# Altium schematic sheet Buck_60W20V_Control_Section.SchDoc
size A4; SheetNumber: 3; SheetTotal: 6
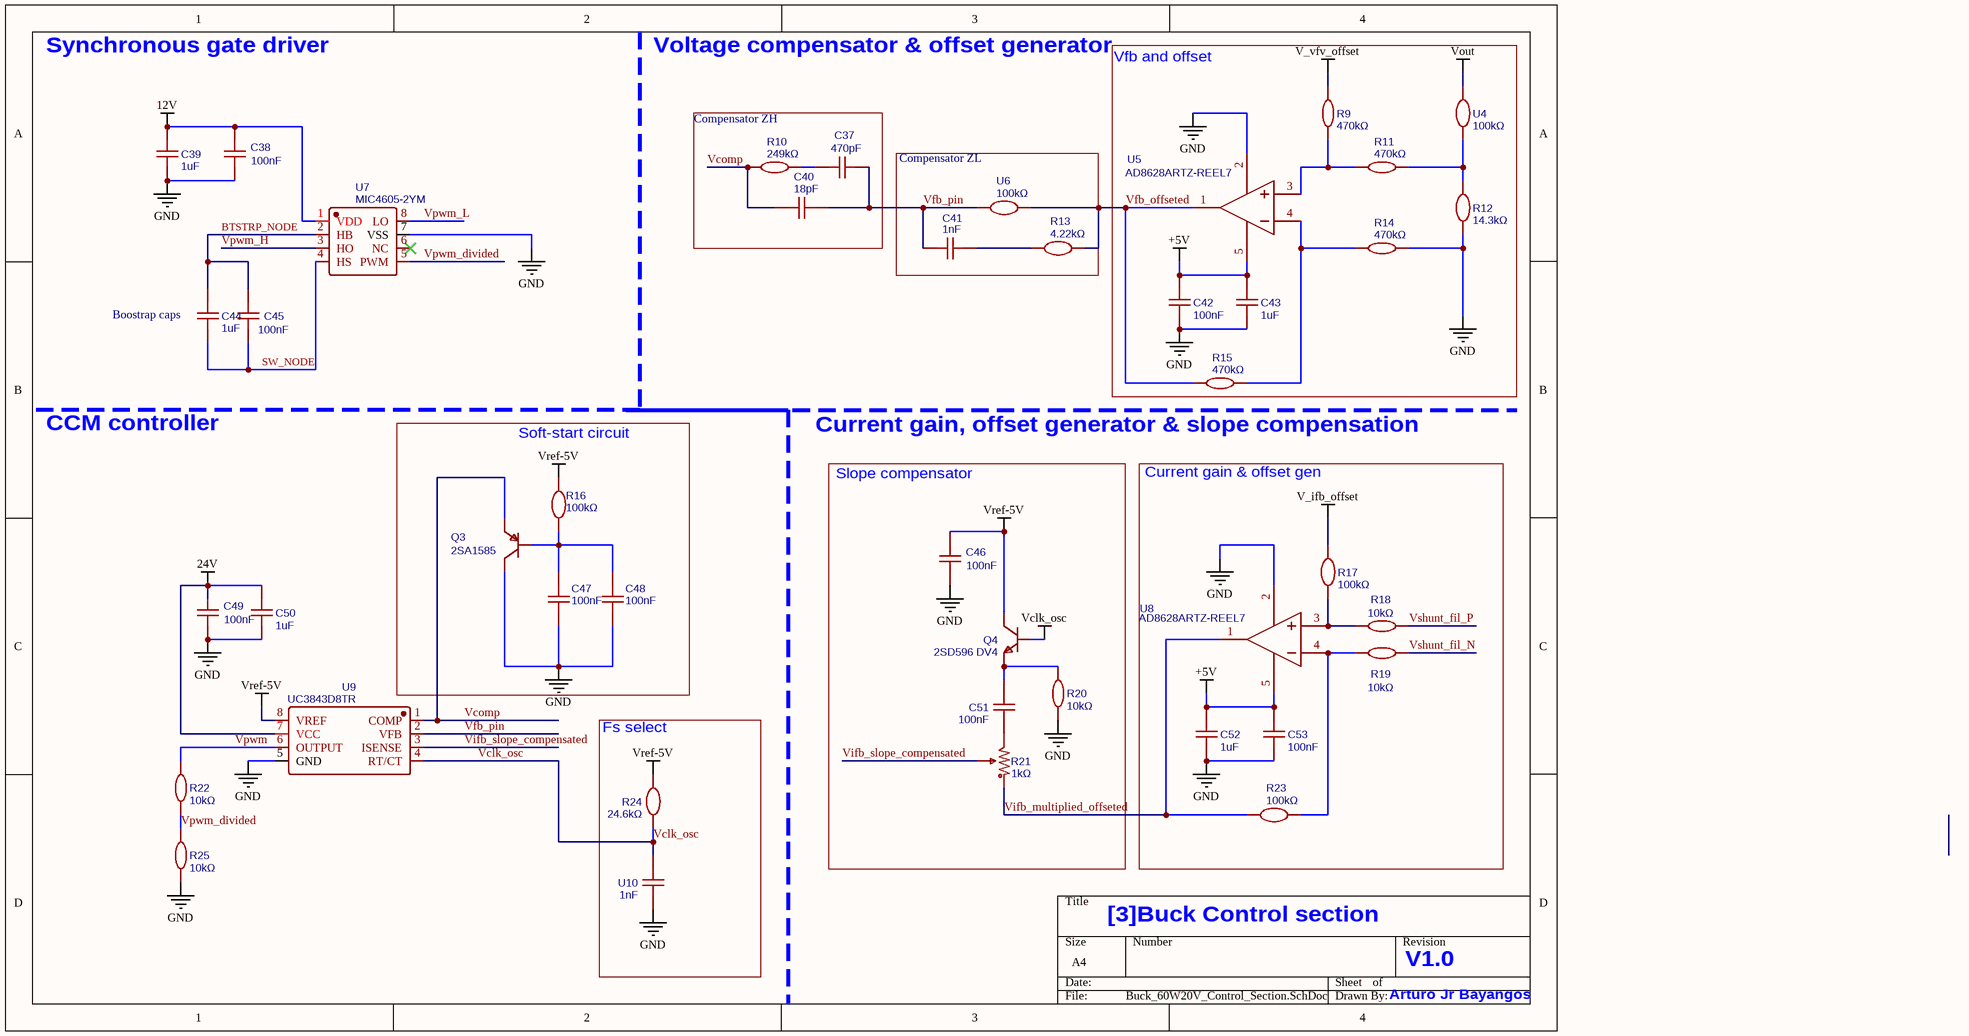
[diagram p0: Buck_60W20V_Control_Section.SchDoc]

## Parts
C37  470pF  [C0603]
C38  100nF  [C0402]
C39  1uF  [C0603]
C40  18pF  [C0603]
C41  1nF  [C0603]
C42  100nF  [C0402]
C43  1uF  [C0603]
C44  1uF  [C0603]
C45  100nF  [C0402]
C46  100nF  [C0402]
C47  100nF  [C0402]
C48  100nF  [C0402]
C49  100nF  [C0402]
C50  1uF  [C0603]
C51  100nF  [C0402]
C52  1uF  [C0603]
C53  100nF  [C0402]
Q3  2SA1585  [SOT-23-3_L2.9-W1.6-P1.90-LS2.8-BR]
Q4  2SD596 DV4  [SOT-23-3_L2.9-W1.6-P1.90-LS2.8-BR]
R9  470kΩ  [R0603]
R10  249kΩ  [R0603]
R11  470kΩ  [R0603]
R12  14.3kΩ  [R0603]
R13  4.22kΩ  [R0603]
R14  470kΩ  [R0603]
R15  470kΩ  [R0603]
R16  100kΩ  [R0603]
R17  100kΩ  [R0603]
R18  10kΩ  [R0603]
R19  10kΩ  [R0603]
R20  10kΩ  [R0603]
R21  1kΩ  [RES-ADJ-TH_3296W]
R22  10kΩ  [R0603]
R23  100kΩ  [R0603]
R24  24.6kΩ  [R0603]
R25  10kΩ  [R0603]
U4  100kΩ  [R0603]
U5  AD8628ARTZ-REEL7  [SOT-23-5_L3.0-W1.7-P0.95-LS2.8-BR]
U6  100kΩ  [R0603]
U7  MIC4605-2YM  [SOIC-8_L4.9-W3.9-P1.27-LS6.0-BL]
U8  AD8628ARTZ-REEL7  [SOT-23-5_L3.0-W1.7-P0.95-LS2.8-BR]
U9  UC3843D8TR  [SOIC-8_L4.9-W3.9-P1.27-LS6.0-TL]
U10  1nF  [C0201]

## Blocks framed on the sheet
Vfb and offset: C42 C43 R9 R11 R12 R14 R15 U4 U5
Compensator ZH: C37 C40 R10
Compensator ZL: C41 R13 U6
Soft-start circuit: C47 C48 Q3 R16
Slope compensator: C46 C51 Q4 R20 R21
Current gain & offset gen: C52 C53 R17-R19 R23 U8
Fs select: R24 U10

## Nets
12V: C38.2 C39.1 U7.1(VDD)
24V: C49.2 C50.2 U9.7(VCC)
+5V: C42.2 C43.2 C52.2 C53.2 U5.5(+V) U8.5(+V)
GND: C38.1 C39.2 C42.1 C43.1 C46.1 C47.1 C48.1 C49.1 C50.1 C52.1 C53.1 Q3.3(C) R12.1 R14.2 R20.1 R25.1 U5.2(-V) U7.7(VSS) U8.2(-V) U9.5(GND) U10.1
V_ifb_offset: R17.2
V_vfv_offset: R9.2
Vclk_osc: Q4.1(B) R24.1 U9.4(RT/CT) U10.2
Vout: U4.2
Vref-5V: C46.2 Q4.3(C) R16.2 R24.2 U9.8(VREF)
BTSTRP_NODE: C44.1 C45.2 U7.2(HB)
SW_NODE: C44.2 C45.1 U7.4(HS)
Vcomp: C40.2 Q3.2(E) R10.2 U9.1(COMP)
Vfb_offseted: R13.2 R15.1 U5.1(OUT) U6.1
Vfb_pin: C37.2 C40.1 C41.1 U6.2 U9.2(VFB)
Vifb_multiplied_offseted: R21.1 R23.1 U8.1(OUT)
Vifb_slope_compensated: R21.2 U9.3(ISENSE)
Vpwm: R22.2 U9.6(OUTPUT)
Vpwm_divided: R22.1 R25.2 U7.5(PWM)
Vpwm_H: U7.3(HO)
Vpwm_L: U7.8(LO)
Vshunt_fil_N: R19.2
Vshunt_fil_P: R18.2
NetC37_1: C37.1 R10.1
NetC41_2: C41.2 R13.1
NetC47_2: C47.2 C48.2 Q3.1(B) R16.1
NetC51_1: C51.1 R21.3
NetC51_2: C51.2 Q4.2(E) R20.2
NetR9_1: R9.1 R11.1 U5.3(+IN)
NetR11_2: R11.2 R12.2 U4.1
NetR14_1: R14.1 R15.2 U5.4(-IN)
NetR17_1: R17.1 R18.1 U8.3(+IN)
NetR19_1: R19.1 R23.2 U8.4(-IN)

Not connected (* = marked no-connect by the designer): U7 6(NC)*

## Notes on the sheet
- Synchronous gate driver
- Voltage compensator & offset generator
- (near C44) Boostrap caps
- CCM controller
- (near R15) Current gain, offset generator & slope compensation
- [3]Buck Control section
- V1.0
- Arturo Jr Bayangos

## Library data of the parts
C37 = 470pF: Manufacturer: YAGEO(国巨); Manufacturer Part: CC0603GRNPO9BN471; nameAlias: Capacitance; Contributor: LCSC; Supplier: LCSC; Supplier Part: C327194; JLCPCB Part Class: Extended Part; spicePre: C; spiceSymbolName: CC0603GRNPO9BN471
C38 C42 C45-C49 C51 C53 = 100nF: Manufacturer: TAIYO YUDEN(太诱); Manufacturer Part: UMK105B7104KV-FR; nameAlias: Capacitance; Contributor: lcsc; Supplier: LCSC; Supplier Part: C2167491; JLCPCB Part Class: Extended Part; spicePre: C; spiceSymbolName: UMK105B7104KV-FR
C39 C43 C44 C50 C52 = 1uF: Manufacturer: TAIYO YUDEN(太诱); Manufacturer Part: TMK107AB7105KAHT; nameAlias: Capacitance; Contributor: LCSC; Supplier: LCSC; Supplier Part: C386079; JLCPCB Part Class: Extended Part; spicePre: C; spiceSymbolName: TMK107AB7105KAHT
C40 = 18pF: Manufacturer: Walsin(华新科); Manufacturer Part: 0603N180G500; nameAlias: Capacitance; Contributor: LCSC; Supplier: LCSC; Supplier Part: C152921; JLCPCB Part Class: Extended Part; spicePre: C; spiceSymbolName: 0603N180G500
C41 = 1nF: Manufacturer: YAGEO(国巨); Manufacturer Part: CC0603GRNPO8BN102; nameAlias: Capacitance; Contributor: LCSC; Supplier: LCSC; Supplier Part: C519480; JLCPCB Part Class: Extended Part; spicePre: C; spiceSymbolName: CC0603GRNPO8BN102
Q3 = 2SA1585: Manufacturer: CJ(江苏长电/长晶); Supplier: LCSC; Manufacturer Part: 2SA1585; Supplier Part: C92477; JLCPCB Part Class: Extended Part; spicePre: Q; spiceSymbolName: 2SA1585
Q4 = 2SD596 DV4: Manufacturer: CJ(江苏长电/长晶); Supplier: LCSC; Manufacturer Part: 2SD596; Supplier Part: C8546; JLCPCB Part Class: Extended Part; spicePre: Q; spiceSymbolName: 2SD596 DV4
R9 R11 R14 R15 = 470kΩ: Manufacturer: Viking(光颉); Manufacturer Part: AR03BTCX4703; Resistance (Ohms): 470K; nameAlias: Resistance; Contributor: LCSC; Supplier: LCSC; Supplier Part: C319595; JLCPCB Part Class: Extended Part; spicePre: R; spiceSymbolName: AR03BTCX4703
R10 = 249kΩ: Manufacturer: Viking(光颉); Manufacturer Part: ARG03FTC2493; Resistance (Ohms): 249K; nameAlias: Resistance; Contributor: LCSC; Supplier: LCSC; Supplier Part: C217902; JLCPCB Part Class: Extended Part; spicePre: R; spiceSymbolName: ARG03FTC2493
R12 = 14.3kΩ: Manufacturer: YAGEO(国巨); Manufacturer Part: RT0603BRE0714K3L; Contributor: LCSC; nameAlias: Resistance; Supplier: LCSC; Supplier Part: C705810; JLCPCB Part Class: Extended Part; spicePre: R; spiceSymbolName: RT0603BRE0714K3L
R13 = 4.22kΩ: Manufacturer: VISHAY(威世); Manufacturer Part: CRCW06034K22FKEA; Contributor: LCSC; nameAlias: Resistance; Supplier: LCSC; Supplier Part: C843958; JLCPCB Part Class: Extended Part; spicePre: R; spiceSymbolName: CRCW06034K22FKEA
R16 R17 R23 = 100kΩ: Manufacturer: Viking(光颉); Manufacturer Part: ARG03BTC1003; nameAlias: Resistance; Contributor: LCSC; Supplier: LCSC; Supplier Part: C335088; JLCPCB Part Class: Extended Part; spicePre: R; spiceSymbolName: ARG03BTC1003
R18-R20 R22 R25 = 10kΩ: Manufacturer: Viking(光颉); Manufacturer Part: ARG03BTC1002; Resistance (Ohms): 10K; nameAlias: Resistance; Contributor: LCSC; Supplier: LCSC; Supplier Part: C309083; JLCPCB Part Class: Extended Part; spicePre: R; spiceSymbolName: ARG03BTC1002
R21 = 1kΩ: Manufacturer: BOCHEN(博晨); Manufacturer Part: 3296W-1-102-8mm; Contributor: LCSC; nameAlias: Resistance; Supplier: LCSC; Supplier Part: C2766201; JLCPCB Part Class: Extended Part; spicePre: R; spiceSymbolName: 3296W-1-102_C2766201
R24 = 24.6kΩ: Manufacturer: YAGEO(国巨); Manufacturer Part: RT0603BRD0724K6L; Contributor: lcsc; Supplier: LCSC; Supplier Part: C861250; link: https://atta.szlcsc.com/upload/public/pdf/source/20200610/C326738_5639A9F1B6EB6E4AE2197577D3456E7F.pdf; Resistance: 24.6kΩ; JLCPCB Part Class: Extended Part; spicePre: U; spiceSymbolName: RT0603BRD0724K6L
U4 U6 = 100kΩ: Manufacturer: Milliohm(毫欧); Manufacturer Part: HoAR0603-1/10W-100KR-0.1%-TCR25; Contributor: lcsc; nameAlias: Resistance; Supplier: LCSC; Supplier Part: C2912578; link: https://atta.szlcsc.com/upload/public/pdf/source/20211109/80E8454F2972BA066150A8F7FC6D6E27.pdf; JLCPCB Part Class: Extended Part; spicePre: U; spiceSymbolName: HOAR0603-1/10W-100KR-0.1%-TCR25
U5 U8 = AD8628ARTZ-REEL7: Manufacturer: ADI(亚德诺)/LINEAR(凌特); Supplier: LCSC; Manufacturer Part: AD8628ARTZ-REEL7; Supplier Part: C29309; JLCPCB Part Class: Extended Part; spicePre: U; spiceSymbolName: AD8628ARTZ-REEL7
U7 = MIC4605-2YM: Manufacturer: MICROCHIP(美国微芯); Contributor: lcsc; Supplier: LCSC; Supplier Part: C637550; Manufacturer Part: MIC4605-2YM; link: https://atta.szlcsc.comnull; JLCPCB Part Class: Extended Part; spicePre: U; spiceSymbolName: MIC4605-2YM
U9 = UC3843D8TR: Manufacturer: TI(德州仪器); Contributor: LCSC; Supplier: LCSC; Supplier Part: C702405; Manufacturer Part: UC3843D8TR; JLCPCB Part Class: Extended Part; spicePre: U; spiceSymbolName: UC3843D8TR
U10 = 1nF: Manufacturer: muRata(村田); Manufacturer Part: GRM0335C1E102GA01D; Contributor: lcsc; nameAlias: Capacitance; Supplier: LCSC; Supplier Part: C710792; link: https://atta.szlcsc.com/upload/public/pdf/source/20211111/EBEF29B8ECF80458B1789391354759AD.pdf; spicePre: U; spiceSymbolName: GRM0335C1E102GA01D